# EAGLE design MK1 (EAGLE 7.0.0)
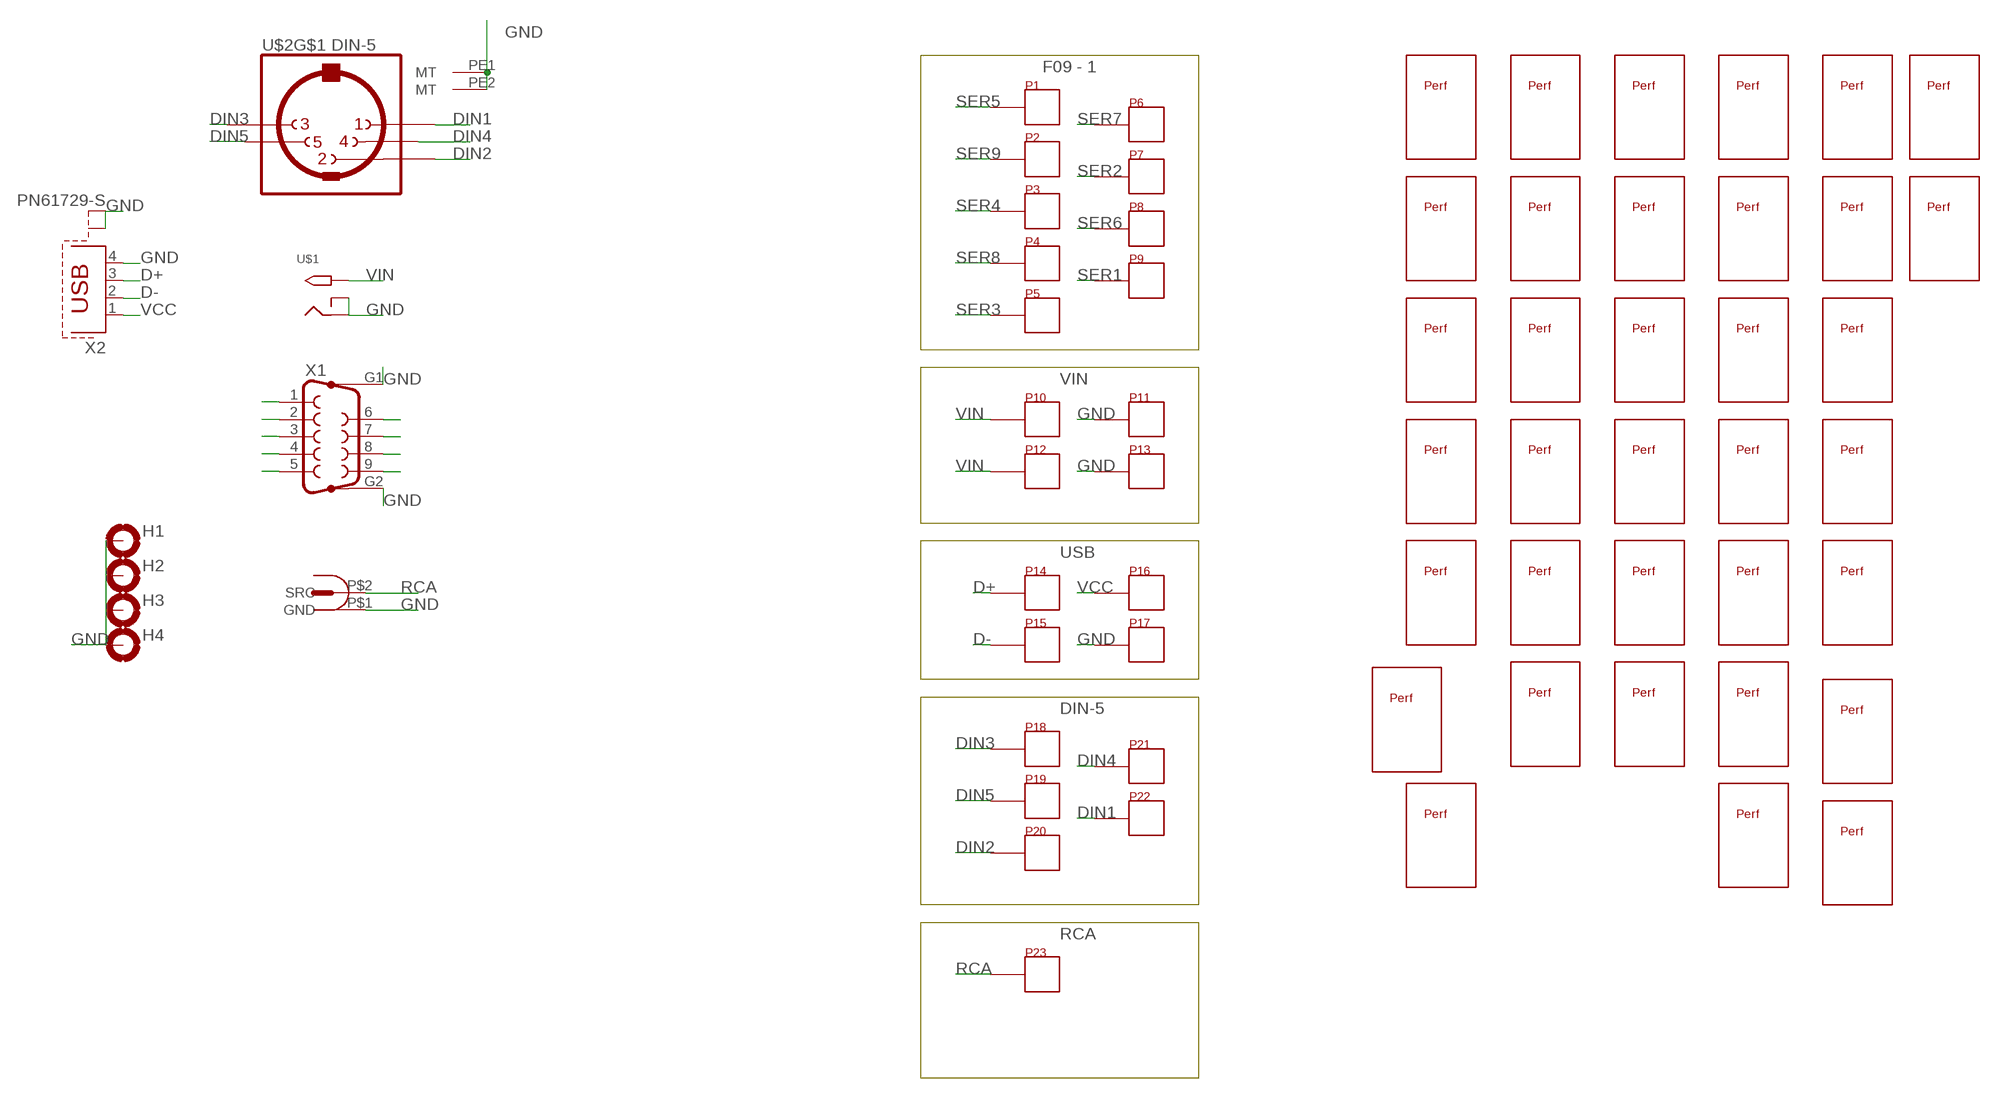
[diagram p0: schematic, sheet 1]

## Parts
H1  MOUNT-PAD-ROUND3.0  [3,0-PAD]
H2  MOUNT-PAD-ROUND3.0  [3,0-PAD]
H3  MOUNT-PAD-ROUND3.0  [3,0-PAD]
H4  MOUNT-PAD-ROUND3.0  [3,0-PAD]
P1  X3-PAD  [X3-PAD]
P2  X3-PAD  [X3-PAD]
P3  X3-PAD  [X3-PAD]
P4  X3-PAD  [X3-PAD]
P5  X3-PAD  [X3-PAD]
P6  X3-PAD  [X3-PAD]
P7  X3-PAD  [X3-PAD]
P8  X3-PAD  [X3-PAD]
P9  X3-PAD  [X3-PAD]
P10  X3-PAD  [X3-PAD]
P11  X3-PAD  [X3-PAD]
P12  X3-PAD  [X3-PAD]
P13  X3-PAD  [X3-PAD]
P14  X3-PAD  [X3-PAD]
P15  X3-PAD  [X3-PAD]
P16  X3-PAD  [X3-PAD]
P17  X3-PAD  [X3-PAD]
P18  X3-PAD  [X3-PAD]
P19  X3-PAD  [X3-PAD]
P20  X3-PAD  [X3-PAD]
P21  X3-PAD  [X3-PAD]
P22  X3-PAD  [X3-PAD]
P23  X3-PAD  [X3-PAD]
U$1  2.1MMJACKTHM  [PJ-102A]
U$2  DIN-5  MIDIJACK  [CP-2350]
U$3  PERF  [PERF]
U$4  PERF  [PERF]
U$5  PERF  [PERF]
U$6  PERF  [PERF]
U$7  PERF  [PERF]
U$8  PERF  [PERF]
U$9  PERF  [PERF]
U$10  PERF  [PERF]
U$11  PERF  [PERF]
U$12  PERF  [PERF]
U$13  PERF  [PERF]
U$14  PERF  [PERF]
U$15  PERF  [PERF]
U$16  PERF  [PERF]
U$17  PERF  [PERF]
U$18  PERF  [PERF]
U$19  PERF  [PERF]
U$20  PERF  [PERF]
U$21  PERF  [PERF]
U$22  PERF  [PERF]
U$23  PERF  [PERF]
U$24  PERF  [PERF]
U$25  PERF  [PERF]
U$26  PERF  [PERF]
U$27  PERF  [PERF]
U$28  PERF  [PERF]
U$29  PERF  [PERF]
U$30  PERF  [PERF]
U$31  PERF  [PERF]
U$32  PERF  [PERF]
U$33  PERF  [PERF]
U$34  PERF  [PERF]
U$35  PERF  [PERF]
U$36  PERF  [PERF]
U$37  PERF  [PERF]
U$38  RCA_VIDEO  [RCA_VIDEO]
X1  F09HP  [F09HP]
X2  PN61729-S  [PN61729-S]

## Nets
D+: P14.1 P14.2 P14.3 X2.3
D-: P15.1 P15.2 P15.3 X2.2
DIN1: P22.1 P22.2 P22.3 U$2.1
DIN2: P20.1 P20.2 P20.3 U$2.2
DIN3: P18.1 P18.2 P18.3 U$2.3
DIN4: P21.1 P21.2 P21.3 U$2.4
DIN5: P19.1 P19.2 P19.3 U$2.5
GND: H1.B3,0(MOUNT) H2.B3,0(MOUNT) H3.B3,0(MOUNT) H4.B3,0(MOUNT) P11.1 P11.2 P11.3 P13.1 P13.2 P13.3 P17.1 P17.2 P17.3 U$1.RING U$1.RING_SW U$2.PE1(MT) U$2.PE2(MT) U$38.P$1(GND) X1.G1 X1.G2 X2.4 X2.S1 X2.S2
RCA: P23.1 P23.2 P23.3 U$38.P$2(SRC)
SER1: P9.1 P9.2 P9.3 X1.1
SER2: P7.1 P7.2 P7.3 X1.2
SER3: P5.1 P5.2 P5.3 X1.3
SER4: P3.1 P3.2 P3.3 X1.4
SER5: P1.1 P1.2 P1.3 X1.5
SER6: P8.1 P8.2 P8.3 X1.6
SER7: P6.1 P6.2 P6.3 X1.7
SER8: P4.1 P4.2 P4.3 X1.8
SER9: P2.1 P2.2 P2.3 X1.9
VCC: P16.1 P16.2 P16.3 X2.1
VIN: P10.1 P10.2 P10.3 P12.1 P12.2 P12.3 U$1.TIP
Unconnected: U$2.PE(MT) U$2.PE@(MT)

## Notes on the sheet
- F09 - 1
- VIN
- USB
- DIN-5
- RCA

## Library data of the parts
H1-H4 = holes:MOUNT-PAD-ROUND: MOUNTING PAD, round
P1-P23 = MyParts:X3-PAD
U$1 = adafruit:2.1MMJACK: 2.1mm x 5.5mm THM DC jack with internal switch. Digikey part #PJ-102A, 4UCON part #05537 2.1mm x 5.5mm SMT DC jack with internal switch. Digikey part #PJ-002A-SMT, 4UCON part #03267 By microbuilder.eu & adafruit.com
U$2 = adafruit:MIDIJACK: DIN 5 jack also known as MIDI jack A modification of conn-hirshman:MAB5SH with two options for the grounding 'teeth'
U$3-U$37 = MyParts:PERF
U$38 = MyParts:RCA_VIDEO
X1 = con-subd:F09HP: SUB-D; OC_FARNELL: unknown; OC_NEWARK: unknown
X2 = con-berg:PN61729-S: BERG USB connector; OC_FARNELL: unknown; OC_NEWARK: unknown

## Board
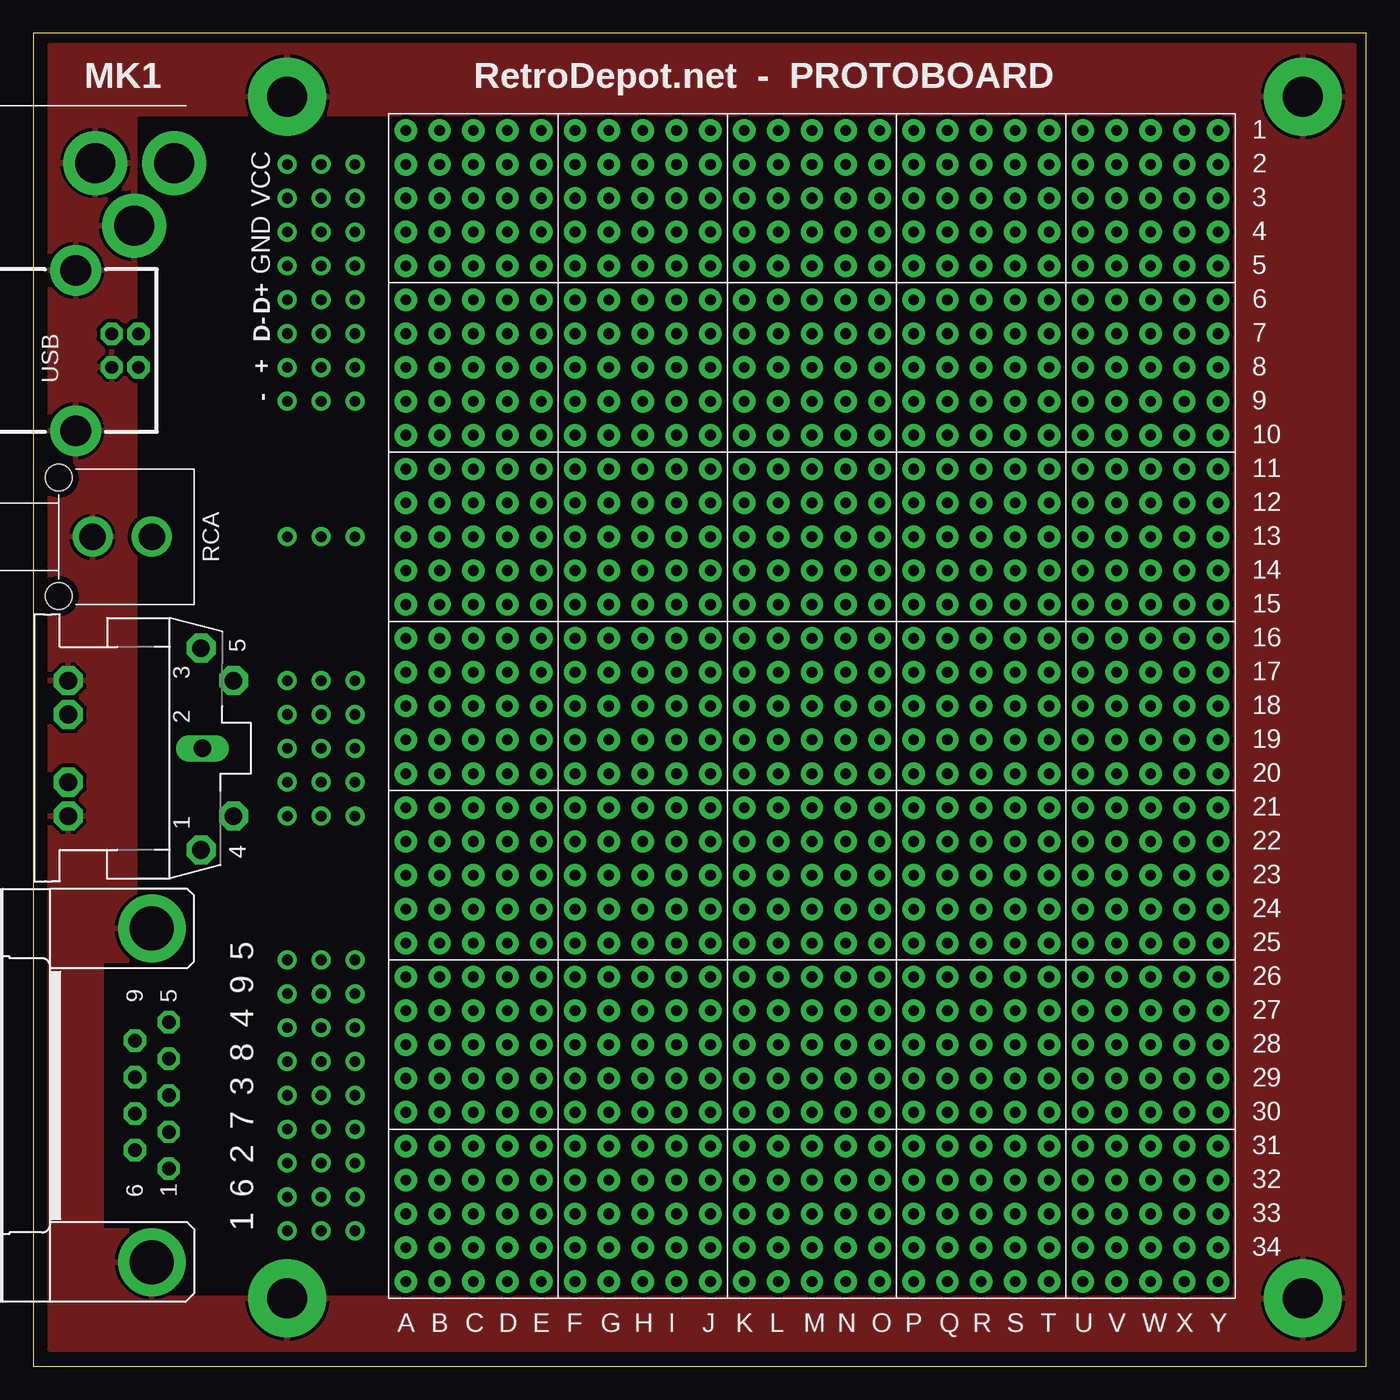
[diagram p1: board, top side]
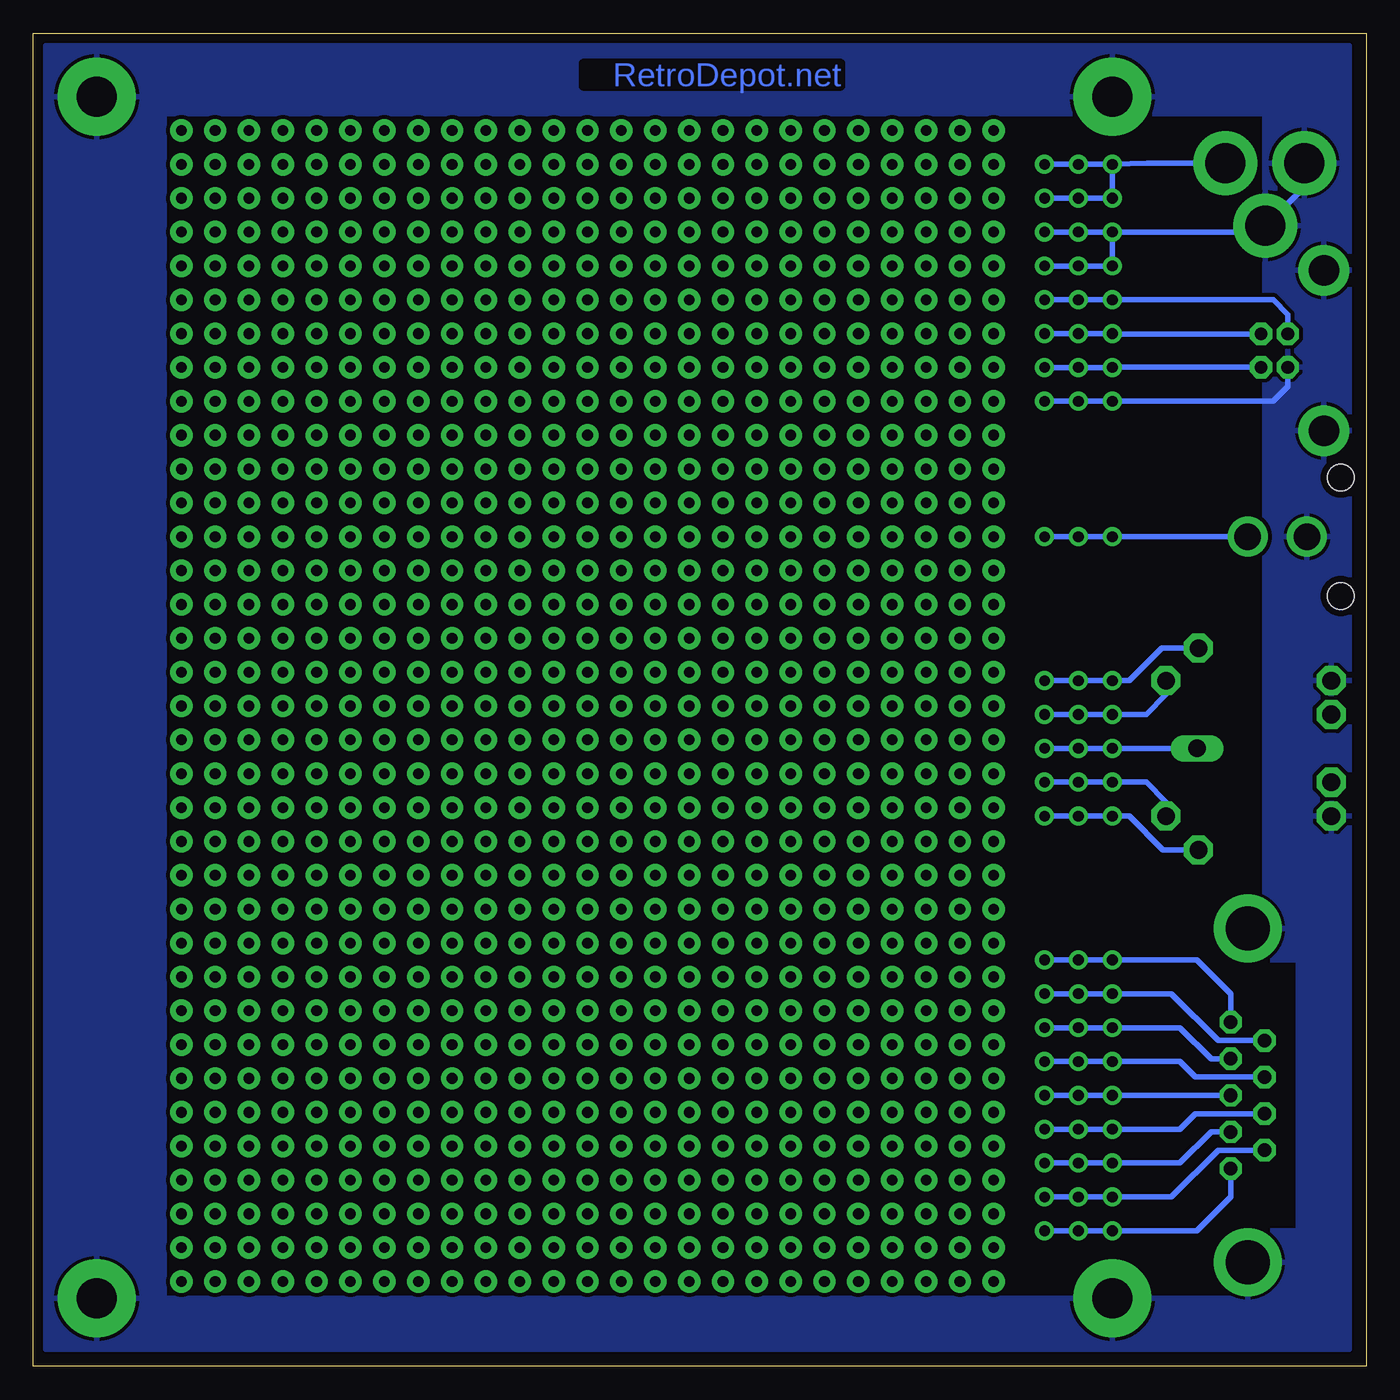
[diagram p2: board, bottom side, seen from below]

Size 100 x 100 mm. Coordinates in mm from the lower left corner, seen from the top.
Outline: 0,0 100,0 100,100 0,100 0,0
Copper layers (1*16): Top 0.035mm / dielectric 1.6mm / Bottom 0.035mm
Design rules "Elecrow_2-layer_PCB_eagle_rule": minimum track width 6mil, minimum drill 12mil, track to track 6mil, track to pad 6mil, pad to pad 6mil, via to via 8mil, smd to smd 0mil, copper to edge 20mil, drill to drill 10mil, minimum pad ring 6mil, minimum via ring 6mil, stop-mask expansion 0mil, vias tented up to drill 100mil, thermal gap 10mil

### Footprints (pad centres in the part's own frame; a part is rotated, then mirrored left to right if it is on the bottom)
3,0-PAD = drill 3 pad 5.842: B3,0 0,0
X3-PAD = drill 0.8 pad 1.422: 1 -2.54,0; 2 0,0; 3 2.54,0
PJ-102A = drill 3 pad 4.8: RING 0.1,-3.39; RING_SW -4.6,-6.29; TIP 0.1,-9.29
CP-2350 = drill 1.321 pad 2.184 octagon: 1 7.62,12.58; 3 -7.52,12.58; 4 5.08,15.02; 5 -5.08,15.02; PE -2.54,2.62; PE1 -5.08,2.62; PE2 5.08,2.62; PE@ 2.54,2.62 | drill 1.321 long: 2 0,12.68
PERF = drill 0.8 pad 1.676: P$1 0,0; P$2 0,2.54; P$3 0,5.08; P$4 0,-2.54; P$5 0,-5.08; P$6 -5.08,5.08; P$7 -5.08,2.54; P$8 -5.08,0; P$9 -5.08,-2.54; P$10 -5.08,-5.08; P$11 -2.54,-5.08; P$12 -2.54,-2.54; P$13 -2.54,0; P$14 -2.54,2.54; P$15 -2.54,5.08; P$16 2.54,5.08; P$17 2.54,2.54; P$18 2.54,0; P$19 2.54,-2.54; P$20 2.54,-5.08; P$21 5.08,-5.08; P$22 5.08,-2.54; P$23 5.08,0; P$24 5.08,2.54; P$25 5.08,5.08
RCA_VIDEO = drill 2: P$1 -0.635,0; P$2 3.81,0 | hole 2: -3.175,4.445; -3.175,-4.445
F09HP = drill 1.016 pad 1.676 octagon: 1 -5.486,-1.27; 2 -2.743,-1.27; 3 0,-1.27; 4 2.743,-1.27; 5 5.486,-1.27; 6 -4.115,1.27; 7 -1.372,1.27; 8 1.372,1.27; 9 4.115,1.27 | drill 3.302 pad 5.08: G1 -12.522,0; G2 12.522,0
PN61729-S = drill 0.95 pad 1.676 octagon: 1 -1.25,-4.71; 2 1.25,-4.71; 3 1.25,-2.71; 4 -1.25,-2.71 | drill 2.3 pad 3.81: S1 6.02,0; S2 -6.02,0

### Placement (x,y rotation side)
H1  19.05,95.25 0 top
H2  95.25,95.25 0 top
H3  95.25,5.08 0 top
H4  19.05,5.08 0 top
P1  21.59,30.48 0 top
P2  21.59,27.94 0 top
P3  21.59,25.4 0 top
P4  21.59,22.86 0 top
P5  21.59,20.32 0 top
P6  21.59,17.78 0 top
P7  21.59,15.24 0 top
P8  21.59,12.7 0 top
P9  21.59,10.16 0 top
P10  21.59,90.17 0 top
P11  21.59,85.09 0 top
P12  21.59,87.63 0 top
P13  21.59,82.55 0 top
P14  21.59,80.01 0 top
P15  21.59,77.47 0 top
P16  21.59,74.93 0 top
P17  21.59,72.39 0 top
P18  21.59,51.44 0 top
P19  21.59,48.9 0 top
P20  21.59,46.35 0 top
P21  21.59,43.81 0 top
P22  21.59,41.27 0 top
P23  21.59,62.23 180 top
U$1  1.27,90.17 90 top
U$2  0,46.35 270 top
U$3  33.02,87.63 0 top
U$4  33.02,74.93 0 top
U$5  33.02,62.23 0 top
U$6  33.02,49.53 0 top
U$7  33.02,36.83 0 top
U$8  33.02,24.13 0 top
U$9  33.02,11.43 0 top
U$10  45.72,87.63 0 top
U$11  45.72,74.93 0 top
U$12  45.72,62.23 0 top
U$13  45.72,49.53 0 top
U$14  45.72,36.83 0 top
U$15  45.72,24.13 0 top
U$16  45.72,11.43 0 top
U$17  58.42,87.63 0 top
U$18  58.42,74.93 0 top
U$19  58.42,62.23 0 top
U$20  58.42,49.53 0 top
U$21  58.42,36.83 0 top
U$22  58.42,24.13 0 top
U$23  58.42,11.43 0 top
U$24  71.12,87.63 0 top
U$25  71.12,74.93 0 top
U$26  71.12,62.23 0 top
U$27  71.12,49.53 0 top
U$28  71.12,36.83 0 top
U$29  71.12,24.13 0 top
U$30  71.12,11.43 0 top
U$31  83.82,87.63 0 top
U$32  83.82,74.93 0 top
U$33  83.82,62.23 0 top
U$34  83.82,49.53 0 top
U$35  83.82,36.83 0 top
U$36  83.82,24.13 0 top
U$37  83.82,11.43 0 top
U$38  5.08,62.23 0 top
X1  8.89,20.32 90 top
X2  3.17,76.2 90 top

### Tracks (layer width: path | path; a pad name or v marks a point on that pad's centre or on a via)
D+
  Bottom 0.406: X2.3 5.88,78.91 6.99,80.01 P14.1 P14.2 P14.3
D-
  Bottom 0.406: X2.2 19.03,77.45 P15.1 P15.2 P15.3
DIN1
  Bottom 0.406: U$2.1 15.24,38.73 17.78,41.27 P22.1 P22.2 P22.3
DIN2
  Bottom 0.406: U$2.2 P20.1 P20.2 P20.3
DIN3
  Bottom 0.406: U$2.3 15.34,53.88 17.78,51.44 P18.1 P18.2 P18.3
DIN4
  Bottom 0.406: U$2.4 15.02,42.33 16.51,43.81 P21.1 P21.2 P21.3
DIN5
  Bottom 0.406: U$2.5 15.02,50.38 16.51,48.9 P19.1 P19.2 P19.3
GND
  Bottom 0.406: U$1.RING 4.66,88.47 U$1.RING_SW 8.04,85.09 P11.1 | P11.1 P13.1 P13.2 P13.3 | X2.4 5.88,73.49 6.99,72.39 P17.1 P17.2 P17.3 | P11.1 P11.2 P11.3
  pour Bottom (isolate 0.305): 1.27,99.06 99.06,99.06 99.06,93.98 7.62,93.98 7.62,30.48 5.08,30.48 5.08,10.16 7.62,10.16 7.62,5.08 99.06,5.08 99.06,1.27 1.27,1.27
  pour Top (isolate 0.305): 1.27,99.06 99.06,99.06 99.06,93.98 7.62,93.98 7.62,30.48 5.08,30.48 5.08,10.16 7.62,10.16 7.62,5.08 99.06,5.08 99.06,1.27 1.27,1.27
  pour Top (isolate 0.305): 99.06,99.06 90.17,99.06 90.17,1.27 99.06,1.27
  pour Bottom (isolate 0.305): 99.06,99.06 90.17,99.06 90.17,1.27 99.06,1.27
  pour Bottom: 6.99,72.39 5.71,73.66 5.71,75.56 2.54,75.56 2.54,72.39
RCA
  Bottom 0.406: U$38.P$2 P23.3 P23.2 P23.1
SER1
  Bottom 0.406: X1.1 10.16,12.7 12.7,10.16 P9.1 P9.2 P9.3
SER2
  Bottom 0.406: X1.2 11.63,17.58 13.97,15.24 P7.1 P7.2 P7.3
SER3
  Bottom 0.406: X1.3 P5.1 P5.2 P5.3
SER4
  Bottom 0.406: X1.4 11.63,23.06 13.97,25.4 P3.1 P3.2 P3.3
SER5
  Bottom 0.406: X1.5 10.16,27.94 12.7,30.48 P1.1 P1.2 P1.3
SER6
  Bottom 0.406: X1.6 11.1,16.2 14.61,12.7 P8.1 P8.2 P8.3
SER7
  Bottom 0.406: X1.7 12.8,18.95 13.97,17.78 P6.1 P6.2 P6.3
SER8
  Bottom 0.406: X1.8 12.8,21.69 13.97,22.86 P4.1 P4.2 P4.3
SER9
  Bottom 0.406: X1.9 11.1,24.43 14.61,27.94 P2.1 P2.2 P2.3
VCC
  Bottom 0.406: X2.1 19.03,74.95 P16.1 P16.2 P16.3
VIN
  Bottom 0.406: U$1.TIP 16.41,90.27 P10.1 | P10.1 P12.1 P12.3 P12.2 | P10.3 P10.2 P10.1

### Text on the board
Bottom: RetroDepot.net
tPlace: MK1 | RetroDepot.net - PROTOBOARD | 1 | 2 | VCC | 3 | 4 | GND | 5 | D+ | D- | 6 | 7 | + | 8 | - | 9 | 10 | 11 | 12 | 13 | 14 | 15 | 16 | 17 | 18 | 19 | 20 | 21 | 22 | 23 | 24 | 25 | 5 | 26 | 9 | 27 | 4 | 8 | 28 | 29 | 3 | 7 | 30 | 31 | 2 | 6 | 32 | 33 | 1 | 34 | A | B | C | D | E | F | G | H | I | J | K | L | M | N | O | P | Q | R | S | T | U | V | W | X | Y